# EAGLE design LED for Junction Box (EAGLE 9.4.2)
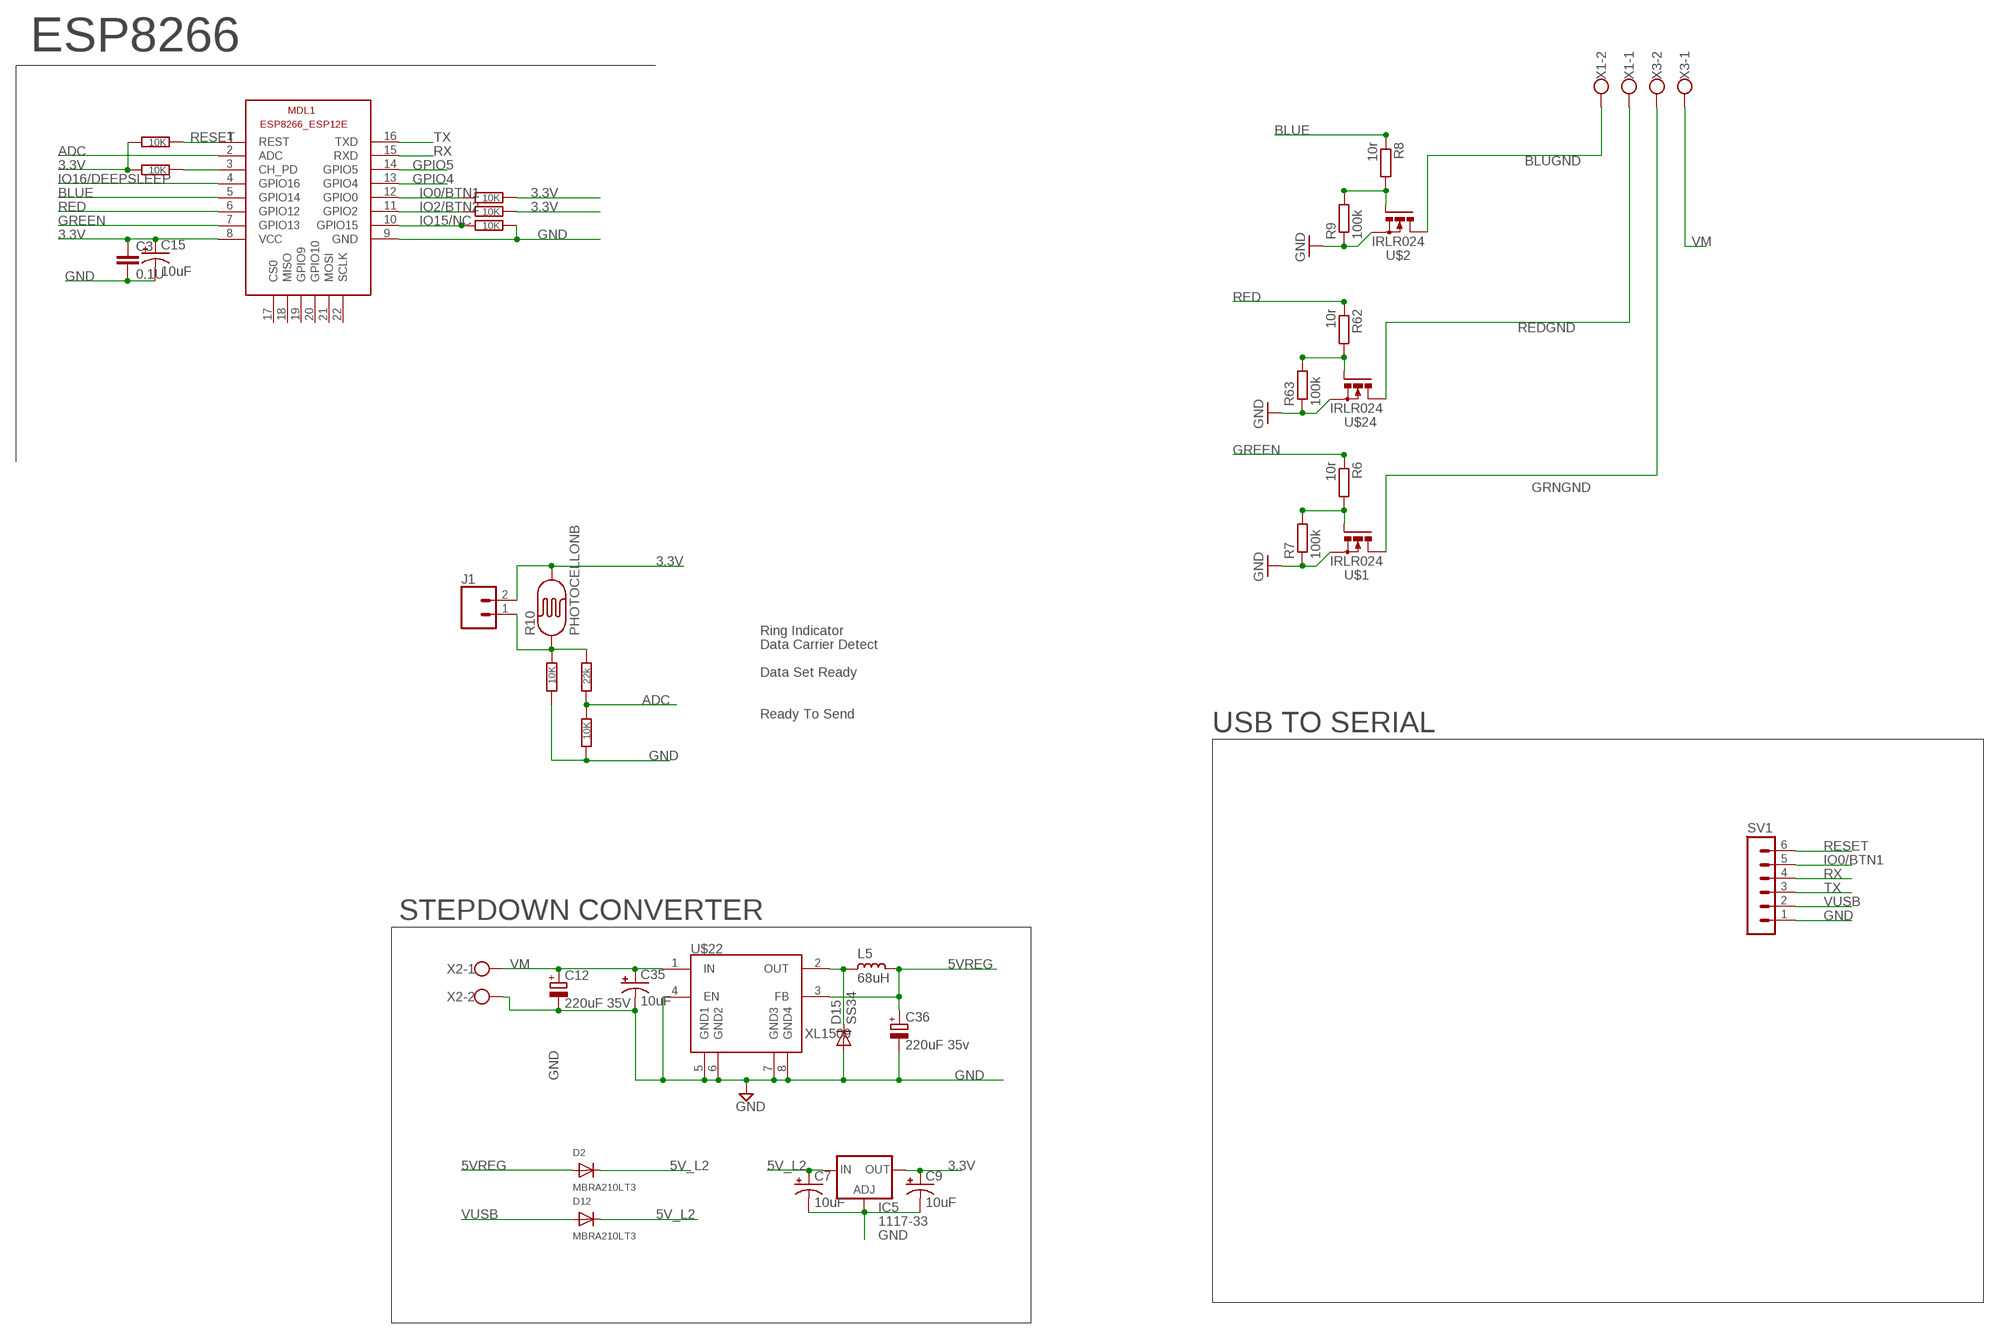
[diagram p0: schematic, sheet 1]

## Parts
C3  0.1U  C-EUC1206  [C1206]
C7  10uF  CAP_POL1206  [EIA3216]
C9  10uF  CAP_POL1206  [EIA3216]
C12  220uF 35V  CPOL-EUE3.5-8  [E3,5-8]
C15  10uF  CAP_POL1206  [EIA3216]
C35  10uF  CAP_POL1206  [EIA3216]
C36  220uF 35v  CPOL-EUE3.5-8  [E3,5-8]
D2  MBRA210LT3  DIODESMA  [SMADIODE]
D12  MBRA210LT3  DIODESMA  [SMADIODE]
D15  SS34  DIODE-DO-214AC  [DO-214AC]
IC5  1117-33  LD117AS33TR  [SOT223]
J1  CONN_02LOCK  [1X02_LOCK]
L5  68uH  L_CD75  [CD75]
MDL1  ESP8266-12EESP8266-ESP12E  [ESP8266-ESP12E]
R3  22k  R-EU_R1206  [R1206]
R4  10K  R-EU_R1206  [R1206]
R5  10K  R-EU_R1206  [R1206]
R6  10r  R-EU_R1206  [R1206]
R7  100k  R-EU_R1206  [R1206]
R8  10r  R-EU_R1206  [R1206]
R9  100k  R-EU_R1206  [R1206]
R10  PHOTOCELLONB  [ON_BOARD]
R11  10K  R-EU_R1206  [R1206]
R12  10K  R-EU_R1206  [R1206]
R28  10K  R-EU_R1206  [R1206]
R29  10K  R-EU_R1206  [R1206]
R31  10K  R-EU_R1206  [R1206]
R62  10r  R-EU_R1206  [R1206]
R63  100k  R-EU_R1206  [R1206]
SV1  MA06-1  [MA06-1]
U$1  IRLR024  N-POWER-MOSFETDPAK-MOSFET  [D-PAK_TO252AA]
U$2  IRLR024  N-POWER-MOSFETDPAK-MOSFET  [D-PAK_TO252AA]
U$22  XL1509  [SO08]
U$24  IRLR024  N-POWER-MOSFETDPAK-MOSFET  [D-PAK_TO252AA]
X1  W237-102  [W237-102]
X2  W237-102  [W237-102]
X3  W237-102  [W237-102]

## Nets
3.3V: C3.1 C9.A(+) C15.A(+) IC5.4(OUT) J1.2 MDL1.8(VCC) R10.2 R11.2 R12.2 R28.1 R29.1
5V_L2: C7.A(+) D2.C D12.C IC5.3(IN)
5VREG: C36.+ D2.A L5.1 U$22.3(FB)
ADC: MDL1.2(ADC) R3.1 R4.2
BLUE: MDL1.5(GPIO14) R8.1
BLUGND: U$2.4(D) X1.2
GND: C3.2 C7.C(-) C9.C(-) C12.- C15.C(-) C35.C(-) C36.- D15.2(A) IC5.1(ADJ) MDL1.9(GND) R4.1 R5.1 R7.1 R9.1 R31.2 R63.1 SV1.1 U$1.3(S) U$2.3(S) U$22.4(EN) U$22.5(GND1) U$22.6(GND2) U$22.7(GND3) U$22.8(GND4) U$24.3(S) X2.2
GPIO4: MDL1.13(GPIO4)
GPIO5: MDL1.14(GPIO5)
GREEN: MDL1.7(GPIO13) R6.1
GRNGND: U$1.4(D) X3.2
IO0/BTN1: MDL1.12(GPIO0) R12.1 SV1.5
IO2/BTN2: MDL1.11(GPIO2) R11.1
IO15/NC: MDL1.10(GPIO15) R31.1
IO16/DEEPSLEEP: MDL1.4(GPIO16)
N$3: R62.2 R63.2 U$24.1(G)
N$4: D15.1(C) L5.2 U$22.2(OUT)
N$5: R6.2 R7.2 U$1.1(G)
N$7: R8.2 R9.2 U$2.1(G)
N$15: J1.1 R3.2 R5.2 R10.1
N$18: MDL1.3(CH_PD) R28.2
RED: MDL1.6(GPIO12) R62.1
REDGND: U$24.4(D) X1.1
RESET: MDL1.1(REST) R29.2 SV1.6
RX: MDL1.15(RXD) SV1.4
TX: MDL1.16(TXD) SV1.3
VM: C12.+ C35.A(+) U$22.1(IN) X2.1 X3.1
VUSB: D12.A SV1.2
Unconnected: MDL1.17(CS0) MDL1.18(MISO) MDL1.19(GPIO9) MDL1.20(GPIO10) MDL1.21(MOSI) MDL1.22(SCLK)

## Notes on the sheet
- ESP8266
- Ring Indicator
- Data Carrier Detect
- Data Set Ready
- Ready To Send
- USB TO SERIAL
- STEPDOWN CONVERTER

## Library data of the parts
C3 = rcl:C-EU: CAPACITOR, European symbol
C7 C9 C15 C35 = SparkFun:CAP_POL: Capacitor Polarized These are standard SMD and PTH capacitors. Normally 10uF, 47uF, and 100uF in electrolytic and tantalum varieties. Always verify the external diameter of the through hole cap, it varies with capacity, voltage, and manufacturer. The EIA devices should be standard.
C12 C36 = rcl:CPOL-EU: POLARIZED CAPACITOR, European symbol
D2 D12 = microbuilder:DIODE: Diode SMADIODE - SMA Surface Mount Package 20V 1A Schottky Diode Digikey (500mV @ 1A, 500uA Vr @ 20V): 641-1014-6-ND 10V 2A Schottky Diode Digikey (350mV @ 2A, 700uA Vr @ 10V): MBRA210LT3 SOD-123 30V 200mA (800mV Vf, 2uA Vr @ 25V) Schottky Diode (very fast switching for boost, etc.) - Digikey: BAT54T1GOSTR-ND 30V 500mA (430mV Vf, 130uA Vr @ 30V) Schottky Diode - Digikey: B0530W-FDICT-ND MBR120 1A 20V (0.34Vf) Schottky Diode - Digikey: MBR120VLSFT1GOSCT-ND SOD-323 10V 570mA (380mV Vf, 3ns) Schottky Diode - Digikey: ZLLS410CT-ND 1N4148WS - 75V 150mA (1V Vf @ 10mA, 4ns) Simple Diode - Digikey: 1N4148WSFSCT-ND, Mouser: 512-1N4148WS SOD-523 BAT54 30V 200mA Schottky (0.8 Vf @ 100mA, 5ns) - Digikey: BAT54XV2CT-ND 30V 30mA Schottky Diode (RB751S-40TE61) - Digikey: RB751S-40TE61CT-ND SOT23-R/W - SOT23 Package (R = Solder Paste/Reflow Ovens, W = Hand-Soldering) BAT54Film 40V 300mA - Digikey: 497-7162-1-ND DO-1N4148 Through Hole Small Current Diode (any model)
D15 = dp_devices:DIODE: Various Diode Packages
IC5 = v-reg:LD117A?*: Low drop fixed and adjustable positive voltage regulators 1 A Source: http://www.st.com/stonline/products/literature/ds/7194/ld1117axx.pdf
J1 = SparkFun-Connectors:CONN_02: Multi connection point. Often used as Generic Header-pin footprint for 0.1 inch spaced/style header connections On any of the 0.1 inch spaced packages, you can populate with these: Break Away Headers - Straight <https://www.sparkfun.com/products/116> (PRT-00116) Break Away Male Headers - Right Angle <https://www.sparkfun.com/products/553> (PRT-00553) Female Headers <https://www.sparkfun.com/products/115> (PRT-00115) Break Away Headers - Machine Pin <https://www.sparkfun.com/products/117> (PRT-00117) Break Away Female Headers - Swiss Machine Pin <https://www.sparkfun.com/products/743> (PRT-00743) For SCREWTERMINALS and SPRING TERMINALS visit here: Screw Terimnals on SparkFun.com <https://www.sparkfun.com/search/results?term=Screw+Terminals> (5mm/3.5mm/2.54mm spacing) This device is also useful as a general connection point to wire up your design to another part of your project. Our various solder wires solder well into these plated through hole pads. Hook-Up Wire - Assortment (Stranded, 22 AWG) <https://www.sparkfun.com/products/11375> (PRT-11375) Hook-Up Wire - Assortment (Solid Core, 22 AWG) <https://www.sparkfun.com/products/11367> (PRT-11367) View the entire wire category on our website here <https://www.sparkfun.com/categories/141> Special notes: Molex polarized connector foot print use with: PRT-08233 with associated crimp pins and housings. 2.54_SCREWTERM for use with PRT-10571. 3.5mm Screw Terminal footprints for PRT-08084 5mm Screw Terminal footprints for use with PRT-08432
L5 = rc-master-smd:L_: INDUCTOR
MDL1 = ESP8266-ESP12E:ESP8266-12E: ESP8266-12E with additional I/O and GPIO04/05 corrected The author cannot warrant that this library is free from error or will meet your specific requirements. Created by PuceBaboon.com. Komagane, Nagano, JAPAN
R3-R5 R11 R12 R28 R29 R31 = rcl:R-EU_: RESISTOR, European symbol
R6-R9 R62 R63 = resistor:R-EU_: RESISTOR, European symbol
R10 = LDR:PHOTOCELL: Photo Resitor
SV1 = con-lstb:MA06-1: PIN HEADER; OC_FARNELL: unknown; OC_NEWARK: unknown
U$1 U$2 U$24 = Cohesion_parts:N-POWER-MOSFET
U$22 = Cohesion_parts:XL1509
X1-X3 = con-wago-500:W237-102: WAGO SCREW CLAMP; MPN: 237-102; OC_FARNELL: unknown; OC_NEWARK: 70K9898

## Board
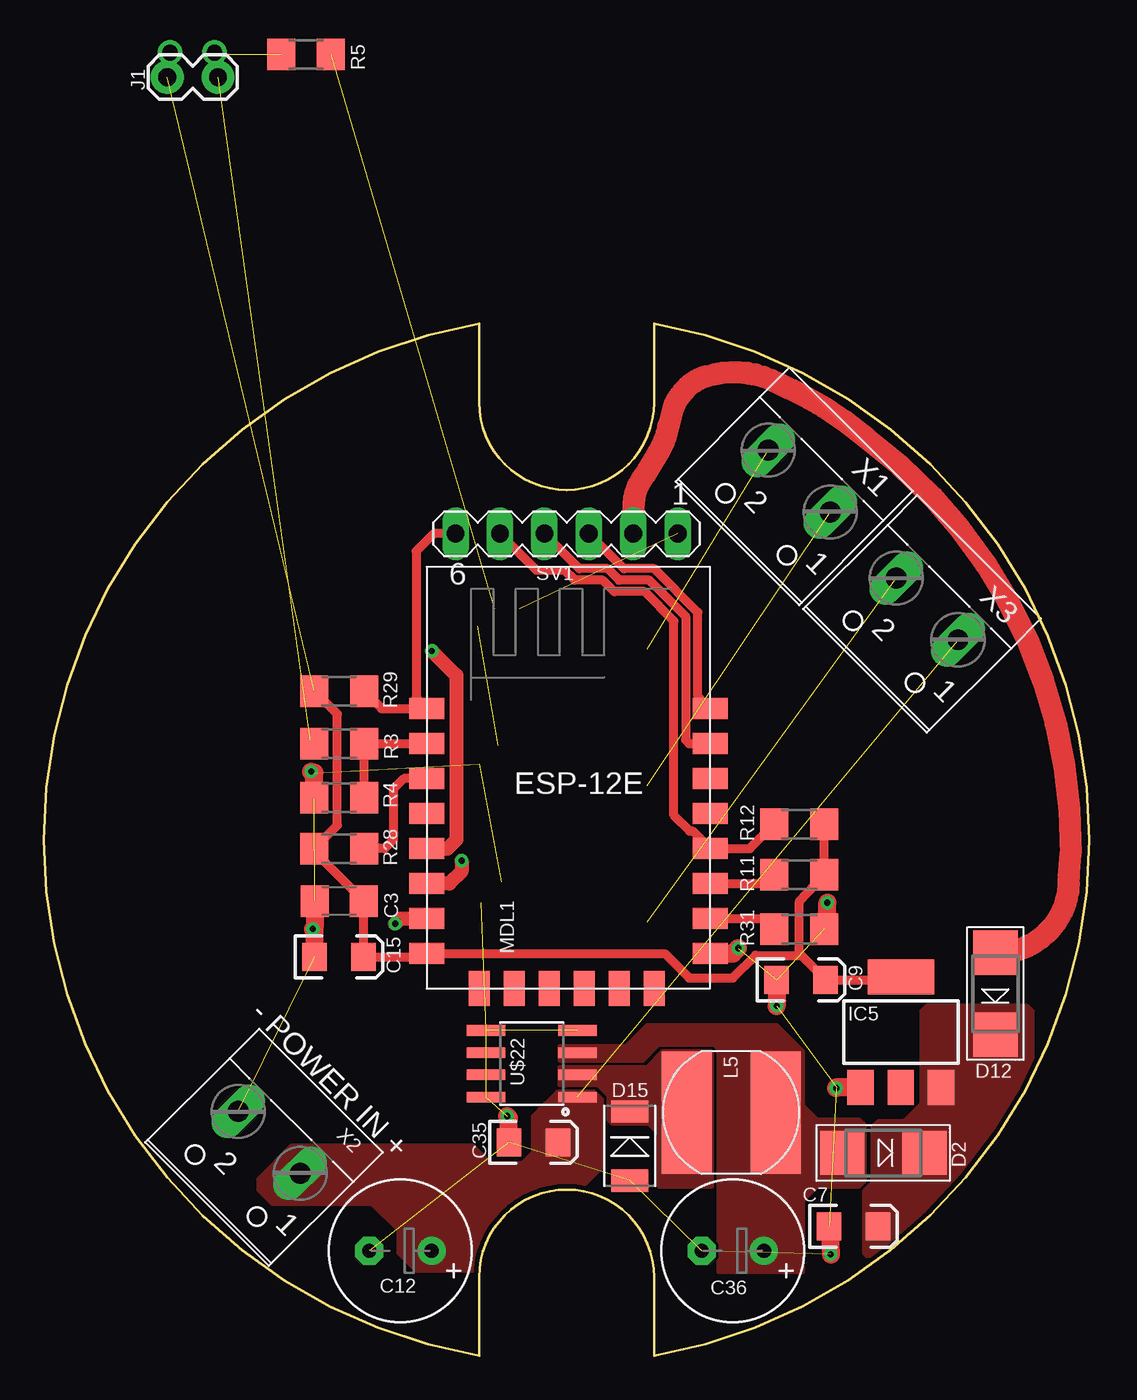
[diagram p1: board, top side]
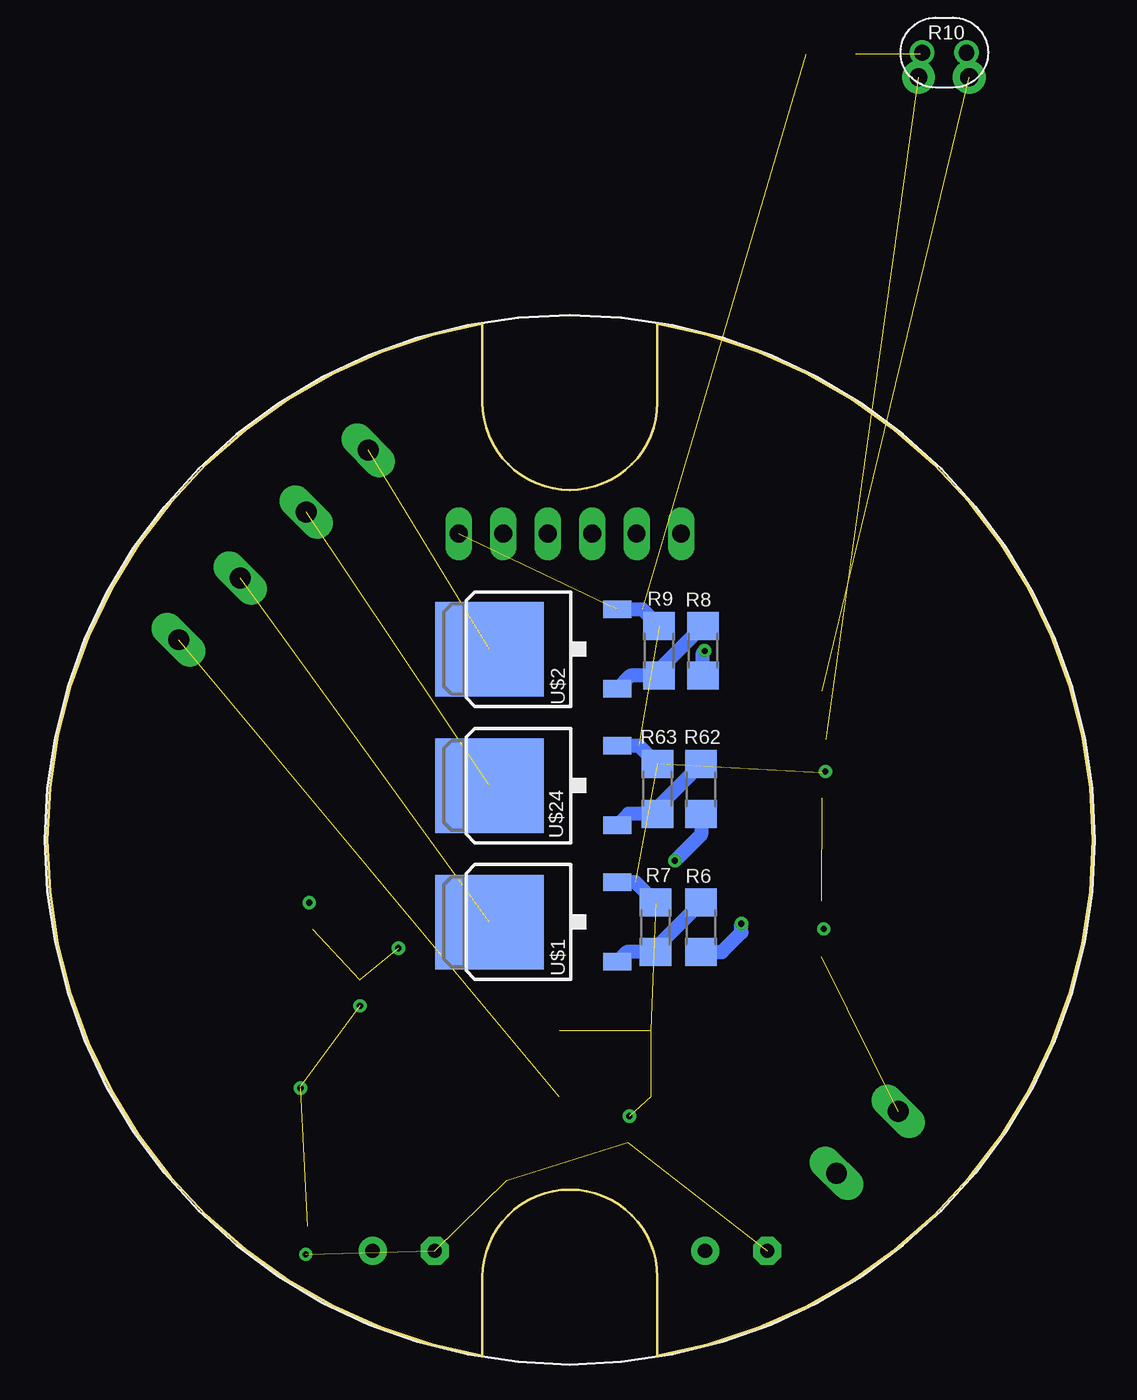
[diagram p2: board, bottom side, seen from below]

Size 59.74 x 59 mm. Coordinates in mm from the lower left corner, seen from the top.
Outline: 24.88,54.5 arc180 34.88,54.5 34.88,59 arc-160 34.88,0 34.88,4.5 arc180 24.88,4.5 24.88,0 arc-161 24.88,59 24.88,54.5
Copper layers (1*16): Top 0.035mm / dielectric 1.5mm / Bottom 0.035mm
Design rules "default *": minimum track width 6mil, minimum drill 0.35mm, track to track 6mil, track to pad 6mil, pad to pad 6mil, via to via 6mil, smd to smd 6mil, copper to edge 10mil, drill to drill 6mil, minimum pad ring 10mil, minimum via ring 8mil, stop-mask expansion 4mil, vias tented up to drill 0mil, thermal gap 10mil

### Footprints (pad centres in the part's own frame; a part is rotated, then mirrored left to right if it is on the bottom)
C1206 = smd 1.6 x 1.8: 1 -1.4,0; 2 1.4,0
EIA3216 = smd 1.4 x 1.6: A 1.4,0; C -1.4,0
E3,5-8 = drill 0.813 pad 1.6: + -1.778,0 | drill 0.813 pad 1.6 octagon: - 1.778,0
SMADIODE = smd 2.54 x 2.54: A 2.349,0; C -2.349,0
DO-214AC = smd 1.27 x 2.1: 1 -1.98,0; 2 1.98,0
SOT223 = smd 1.5 x 2: 1 -2.3,-3.15; 2 0,-3.15; 3 2.3,-3.15 | smd 3.8 x 2: 4 0,3.15
1X02_LOCK = drill 1.016 pad 1.88: 1 -0.178,0; 2 2.718,0
CD75 = smd 7 x 2.85: 1 0,2.54; 2 0,-2.54
ESP8266-ESP12E = smd 2 x 1.2: 1 0,16; 2 0,14; 3 0,12; 4 0,10; 5 0,8; 6 0,6; 7 0,4; 8 0,2; 9 16.2,2; 10 16.2,4; 11 16.2,6; 12 16.2,8; 13 16.2,10; 14 16.2,12; 15 16.2,14; 16 16.2,16 | smd 1.2 x 2: 17 11,0; 18 3,0; 19 5,0; 20 13,0; 21 7,0; 22 9,0
R1206 = smd 1.6 x 1.803: 1 -1.422,0; 2 1.422,0
ON_BOARD = drill 0.9: 1 -1.27,0; 2 1.27,0
MA06-1 = drill 1.016 long: 1 -6.35,0; 2 -3.81,0; 3 -1.27,0; 4 1.27,0; 5 3.81,0; 6 6.35,0
D-PAK_TO252AA = smd 1 x 1.6: 1 -2.28,-4.8; 3 2.28,-4.8 | smd 5.4 x 6.2: 4 0,2.5
SO08 = smd 0.61 x 2.21: 1 -1.905,-2.616; 2 -0.635,-2.616; 3 0.635,-2.616; 4 1.905,-2.616; 5 1.905,2.616; 6 0.635,2.616; 7 -0.635,2.616; 8 -1.905,2.616
W237-102 = drill 1.194 long: 1 -2.5,-1.27; 2 2.5,-1.27

### Placement (x,y rotation side)
C3  16.88,26 180 top
C7  46.28,7.4 0 top
C9  43.28,21.5 0 top
C12  20.38,6 180 top
C15  16.88,22.8 0 top
C35  27.98,12.2 0 top
C36  39.38,6 180 top
D2  47.98,11.6 180 top
D12  54.38,20.7 90 top
D15  33.48,12 270 top
IC5  48.98,18.5 0 top
J1  9.78,73.1 180 top  (outside the outline)
L5  39.28,13.9 270 top
MDL1  21.88,21 0 top
R3  16.88,35 180 top
R4  16.88,31.9 0 top
R5  14.98,74.4 180 top  (outside the outline)
R6  22.38,24.5 90 bottom
R7  24.98,24.5 270 bottom
R8  22.28,40.3 90 bottom
R9  24.78,40.3 270 bottom
R10  8.48,74.5 0 bottom  (outside the outline)
R11  43.18,27.5 0 top
R12  43.18,30.4 0 top
R28  16.88,29 0 top
R29  16.88,38 0 top
R31  43.18,24.4 0 top
R62  22.38,32.4 90 bottom
R63  24.88,32.4 270 bottom
SV1  29.88,47 180 top
U$1  31.98,24.8 90 bottom
U$2  31.98,40.4 90 bottom
U$22  27.88,16.7 90 top
U$24  31.98,32.6 90 bottom
X1  42.28,49.1 135 top
X2  11.98,11.3 135 top
X3  49.58,41.8 135 top

### Tracks (layer width: path | path; a pad name or v marks a point on that pad's centre or on a via)
3.3V  (1 unrouted)
  Top 0.508: 43.08,22.9 40.68,22.9 39.38,21.6 36.88,21.6 35.48,23 MDL1.8 21.68,22.8 C15.A C3.1 15.46,28.82 R28.1 16.78,30.32 16.78,36.68 R29.1 15.23,37.77 | 43.08,22.9 43.28,22.9 C9.A 48.08,21.5 48.23,21.65 IC5.4 | 43.08,22.9 43.18,23 43.18,25.98 R11.2 R12.2 | R10.2 7.21,73.25 J1.2
5V_L2
  pour Top (rank 2, no thermals): 50.18,19.7 50.18,14.4 49.18,13.4 47.68,13.4 47.38,13.1 47.38,9.9 46.88,9.4 46.88,5.9 47.18,5.6 47.58,5.6 arc20 53.78,11.8 arc12 56.48,16.2 56.48,19.7 56.18,20 50.48,20
5VREG
  pour Top (rank 2, no thermals): 29.48,16.9 34.28,16.9 35.18,17.8 38.28,17.8 38.58,17.5 38.58,4.8 43.38,4.8 43.38,8.9 44.18,9.7 46.58,9.7 46.88,10 46.88,13.2 46.58,13.5 44.18,13.5 43.38,14.3 43.38,17.4 41.88,18.9 34.48,18.9 33.28,17.7 29.48,17.7
ADC
  Top 0.508: R3.1 18.48,35 | 18.48,35 MDL1.2 | R4.2 18.3,34.82 18.48,35
BLUE  (via drill 0.35)
  Top 0.813: v22.18,40.3 23.58,38.9 23.58,29.5 23.08,29 MDL1.5
  Bottom 0.813: R8.1 22.28,40.2 v22.18,40.3
BLUGND  (1 unrouted)
GND  (via drill 0.35)  (21 unrouted)
  Top 1.016: IC5.1 45.33,15.35 v45.28,15.3 | C9.C v41.88,20 | MDL1.9 39.38,23 v39.68,23.3 | R31.2 44.78,24.58 v44.78,25.9 | C7.C v44.98,5.8 | C35.C 26.58,13.6 v26.48,13.7 | R4.1 15.46,33.32 v15.28,33.4 | C3.2 15.48,24.5 | 15.48,24.5 v15.38,24.4 | C15.C 15.48,24.5
  Bottom 0.813: U$24.3 25.94,34.88 R63.1 | U$2.3 25.74,42.68 R9.1 | U$1.3 26.14,27.08 R7.1
GREEN  (via drill 0.35)
  Top 0.813: v20.08,24.7 20.38,25 MDL1.7
  Bottom 0.813: R6.1 21.2,23.08 20.08,24.2 v20.08,24.7
GRNGND  (1 unrouted)
IO0/BTN1
  Top 0.508: R12.1 40.36,29 MDL1.12 37.09,29.99 36.91,29.99 36.02,30.89 36.02,42 34.34,43.68 32.61,43.68 31.94,44.34 30.34,44.34 29.78,44.9 28.17,44.9 SV1.5
IO2/BTN2
  Top 0.508: MDL1.11 41.36,27 R11.1
IO15/NC
  Top 0.508: MDL1.10 41.16,25 R31.1
N$3
  Bottom 0.813: R62.2 24.88,31.32 R63.2 26.52,30.98 U$24.1
N$4
  pour Top (no thermals): 29.48,15.5 31.68,15.5 32.28,14.9 32.28,13.5 32.48,13.3 34.58,13.3 35.18,12.7 35.18,9.7 38.18,9.7 38.18,17.3 38.08,17.4 35.38,17.4 34.48,16.5 29.48,16.5
N$5
  Bottom 0.813: R6.2 24.98,23.32 R7.2 26.62,23.08 U$1.1
N$7
  Bottom 0.813: R8.2 24.78,39.22 R9.2 26.42,38.88 U$2.1
N$15  (2 unrouted)
  Top 0.508: R3.2 15.23,35.23 | R10.1 9.75,74.3 | 9.75,74.3 9.75,73.31 J1.1 | 9.85,74.4 9.75,74.3
N$18
  Top 0.508: MDL1.3 20.58,33 19.98,32.4 19.98,29.5 19.48,29 R28.2
RED  (via drill 0.35)
  Top 0.813: v23.88,28.3 23.88,27.7 23.18,27 MDL1.6
  Bottom 0.813: R62.1 22.38,29.8 v23.88,28.3
REDGND  (1 unrouted)
RESET
  Top 0.508: R29.2 19.3,37 MDL1.1 21.28,37.6 21.28,46 22.28,47 SV1.6
RX
  Top 0.508: SV1.4 30.61,45 32.22,45 32.88,44.34 34.61,44.34 36.68,42.27 36.68,35.21 36.88,35 MDL1.15
TX
  Top 0.508: MDL1.16 37.38,37.7 37.38,42.5 34.88,45 33.15,45 SV1.3
VM  (1 unrouted)
  pour Top (rank 2, no thermals): 29.38,15.1 31.48,15.1 31.88,14.7 31.88,10.8 25.98,4.9 21.28,4.9 20.28,5.9 20.28,7.2 18.78,8.7 13.08,8.7 12.28,9.5 12.28,10.1 14.18,12 24.48,12 25.48,11 27.38,11 27.98,11.6 27.98,13.7
VUSB
  Top 1.27: D12.A arc95 58.58,27.35 58.68,28.7 arc54 46.98,52.5 arc16 41.98,55.6 arc45 37.88,56 arc53 35.98,54.2 35.68,53.1 arc-20 34.98,51.4 34.38,50.4 arc39 33.69,48.51 SV1.2

### Text on the board
tPlace: - POWER IN +